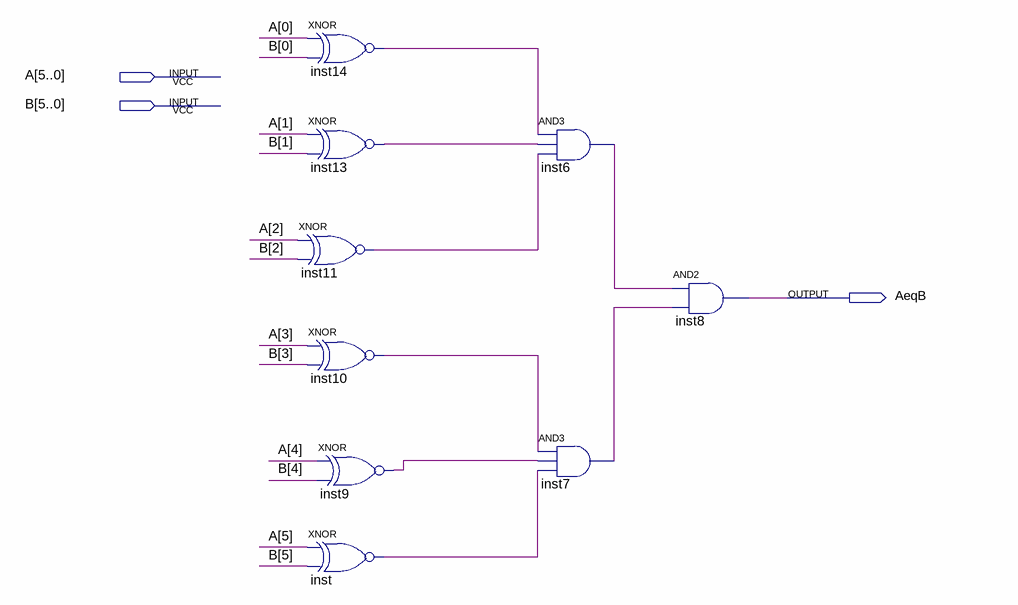
[diagram p0: schematic sheet]
// Quartus schematic G53_comp6.bdf as structural Verilog: 9 symbols, 3 pins
module G53_comp6 (
  input  [5:0] A,
  input  [5:0] B,
  output AeqB
);

  wire inst6_out, inst7_out, inst9_out, inst10_out, inst11_out, inst13_out, inst14_out, inst_out;

  xnor inst14 (inst14_out, A[0], B[0]);
  xnor inst13 (inst13_out, A[1], B[1]);
  xnor inst11 (inst11_out, A[2], B[2]);
  xnor inst10 (inst10_out, A[3], B[3]);
  xnor inst (inst_out, A[5], B[5]);
  xnor inst9 (inst9_out, A[4], B[4]);
  and inst6 (inst6_out, inst14_out, inst13_out, inst11_out);
  and inst7 (inst7_out, inst10_out, inst9_out, inst_out);
  and inst8 (AeqB, inst6_out, inst7_out);
endmodule
